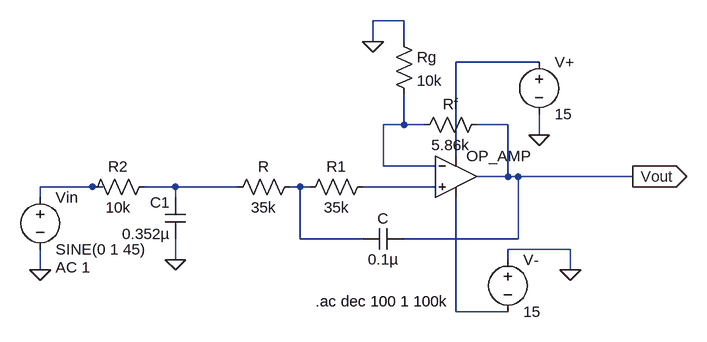
[diagram p0: schematic Butterworth_low_pass_filter_3rd_order.asc]
Butterworth_low_pass_filter_3rd_order.asc, the LTspice schematic file:
Version 4.1
SHEET 1 880 680
WIRE 96 -112 48 -112
WIRE 48 -80 48 -112
WIRE 96 -80 96 -112
WIRE 304 -48 176 -48
WIRE 96 48 96 0
WIRE 96 48 64 48
WIRE 128 48 96 48
WIRE 256 48 208 48
WIRE 304 64 304 32
WIRE 176 96 176 -48
WIRE 64 112 64 48
WIRE 144 112 64 112
WIRE 256 128 256 48
WIRE 256 128 208 128
WIRE 272 128 256 128
WIRE 448 128 272 128
WIRE -384 144 -464 144
WIRE -368 144 -384 144
WIRE -256 144 -304 144
WIRE -160 144 -256 144
WIRE -64 144 -80 144
WIRE -48 144 -64 144
WIRE 144 144 32 144
WIRE -464 160 -464 144
WIRE -256 160 -256 144
WIRE -64 224 -64 144
WIRE 32 224 -64 224
WIRE 272 224 272 128
WIRE 272 224 96 224
WIRE 352 240 256 240
WIRE -256 256 -256 224
WIRE 256 256 256 240
WIRE -464 272 -464 240
WIRE 352 272 352 240
WIRE 176 336 176 160
WIRE 256 336 176 336
FLAG 48 -80 0
FLAG -464 272 0
FLAG 304 64 0
FLAG -256 256 0
FLAG 448 128 Vout
IOPIN 448 128 Out
FLAG 352 272 0
SYMBOL res 224 32 R90
WINDOW 0 0 56 VBottom 2
WINDOW 3 32 56 VTop 2
SYMATTR InstName Rf
SYMATTR Value 5.86k
SYMBOL res 80 -96 R0
SYMATTR InstName Rg
SYMATTR Value 10k
SYMBOL res -64 160 R270
WINDOW 0 32 56 VTop 2
WINDOW 3 0 56 VBottom 2
SYMATTR InstName R1
SYMATTR Value 35k
SYMBOL res -176 160 R270
WINDOW 0 32 56 VTop 2
WINDOW 3 0 56 VBottom 2
SYMATTR InstName R
SYMATTR Value 35k
SYMBOL res -400 160 R270
WINDOW 0 32 56 VTop 2
WINDOW 3 0 56 VBottom 2
SYMATTR InstName R2
SYMATTR Value 10k
SYMBOL cap 32 240 R270
WINDOW 0 32 32 VTop 2
WINDOW 3 0 32 VBottom 2
SYMATTR InstName C
SYMATTR Value 0.1µ
SYMBOL cap -240 224 R180
WINDOW 0 24 56 Left 2
WINDOW 3 24 8 Left 2
SYMATTR InstName C1
SYMATTR Value 0.352µ
SYMBOL OpAmps\\UniversalOpAmp 176 128 R0
SYMATTR InstName OP_AMP
SYMBOL voltage -464 144 R0
WINDOW 123 24 124 Left 2
WINDOW 39 0 0 Left 0
SYMATTR InstName Vin
SYMATTR Value SINE(0 1 45)
SYMATTR Value2 AC 1
SYMBOL voltage 304 -64 R0
WINDOW 123 0 0 Left 0
WINDOW 39 0 0 Left 0
SYMATTR InstName V+
SYMATTR Value 15
SYMBOL voltage 256 240 R0
SYMATTR InstName V-
SYMATTR Value 15
TEXT -40 320 Left 2 !.ac dec 100 1 100k

The netlist it stands for:
* Butterworth_low_pass_filter_3rd_order.asc
Rf Vout N002 5.86k
Rg 0 N002 10k
R1 N005 N006 35k
R N004 N005 35k
R2 N003 N004 10k
C N005 Vout 0.1µ
C1 0 N004 0.352µ
X§OP_AMP N006 N002 N001 N007 Vout level1 Avol=1Meg GBW=10Meg Vos=0 En=0 Enk=0 In=0 Ink=0 Rin=500Meg  ; pins In+ In- V+ V- OUT
Vin N003 0 SINE(0 1 45) AC 1
V+ N001 0 15
V- 0 N007 15
.ac dec 100 1 100k
.lib UniversalOpAmp1.lib
.backanno
.end